# EAGLE design light-painting-brush (EAGLE 9.6.2)
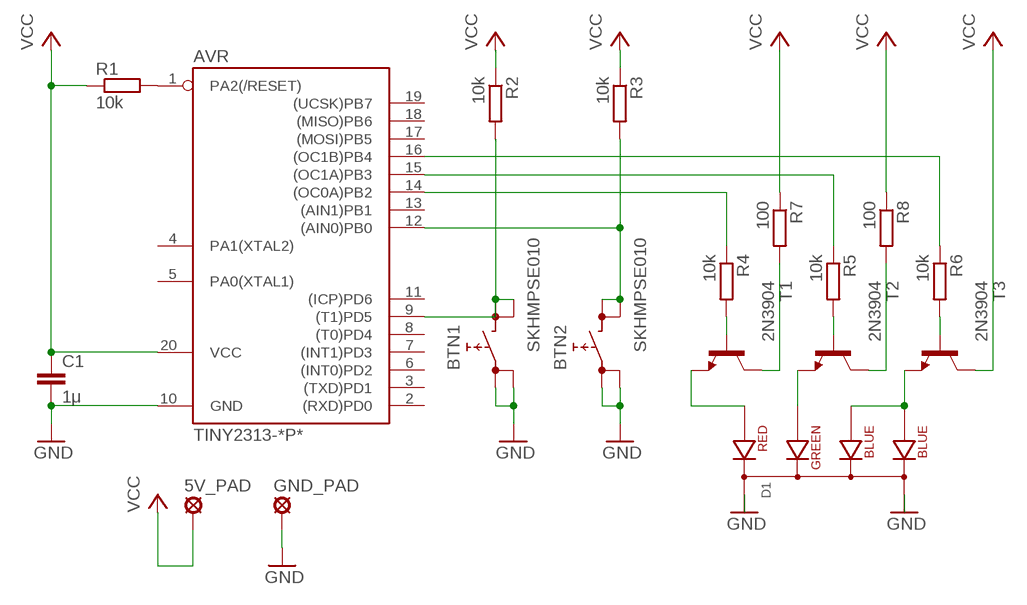
[diagram p0: schematic, sheet 1]

## Parts
5V_PAD  LSP10  [LSP10]
AVR  TINY2313-*P*  [DIL20]
BTN1  SKHMPSE010  [SKHMPXE010]
BTN2  SKHMPSE010  [SKHMPXE010]
C1  1μ  C-EUC1206  [C1206]
D1  LED-RGB-CC-THRUDIFFUSE  [LED-RGB-THRU]
GND_PAD  LSP10  [LSP10]
R1  10k  R-EU_R1206  [R1206]
R2  10k  R-EU_R1206  [R1206]
R3  10k  R-EU_R1206  [R1206]
R4  10k  R-EU_R1206  [R1206]
R5  10k  R-EU_R1206  [R1206]
R6  10k  R-EU_R1206  [R1206]
R7  100  R-EU_R1206  [R1206]
R8  100  R-EU_R1206  [R1206]
T1  2N3904  [TO92]
T2  2N3904  [TO92]
T3  2N3904  [TO92]

## Nets
BLUE: D1.BLUE1 D1.BLUE2 T3.3(E)
BLUE0: AVR.16((OC1B)PB4) R6.1
BLUE1: R6.2 T3.2(B)
GND: AVR.10(GND) BTN1.1(1.1) BTN1.2(1.2) BTN2.1(1.1) BTN2.2(1.2) C1.2 D1.CATHODE1 D1.CATHODE2 GND_PAD.MP
GREEN: D1.GREEN T2.3(E)
GREEN0: AVR.15((OC1A)PB3) R5.1
GREEN1: R5.2 T2.2(B)
GREEN2: R8.2 T2.1(C)
N$1: AVR.1(PA2(/RESET)) R1.2
N$15: AVR.9((T1)PD5) BTN1.3(2.1) BTN1.4(2.2) R2.2
N$16: AVR.12((AIN0)PB0) BTN2.3(2.1) BTN2.4(2.2) R3.2
RED: D1.RED T1.3(E)
RED0: AVR.14((OC0A)PB2) R4.1
RED1: R4.2 T1.2(B)
RED2: R7.2 T1.1(C)
VCC: 5V_PAD.MP AVR.20(VCC) C1.1 R1.1 R2.1 R3.1 R7.1 R8.1 T3.1(C)
Unconnected: AVR.2((RXD)PD0) AVR.3((TXD)PD1) AVR.4(PA1(XTAL2)) AVR.5(PA0(XTAL1)) AVR.6((INT0)PD2) AVR.7((INT1)PD3) AVR.8((T0)PD4) AVR.11((ICP)PD6) AVR.13((AIN1)PB1) AVR.17((MOSI)PB5) AVR.18((MISO)PB6) AVR.19((UCSK)PB7)

## Library data of the parts
5V_PAD GND_PAD = solpad:LSP10: SOLDER PAD drill 1.0 mm, distributor Buerklin, 12H555
AVR = avr-6:TINY2313*: Atmel Tiny2313 2K Flash, 128 bytes EEPROM, 128 bytes RAM
BTN1 BTN2 = Gumix:SKHMP*E010: 6.2 X 6.5mm TACT Switch (SMD) Source: http://www3.alps.co.jp/WebObjects/catalog.woa/PDF/E/Switch/Tact/SKHM/SKHM.PDF
C1 = rcl:C-EU: CAPACITOR, European symbol
D1 = Gumix:LED-RGB-CC-THRU: RGB Through-hole common cathode LED SparkFun Storefront: COM-00105 (Clear) COM-09264 (Diffuse); PROD_ID: DIO-09434
R1-R8 = resistor:R-EU_: RESISTOR, European symbol
T1-T3 = transistor:2N3904: NPN TRANSISTOR

## Board
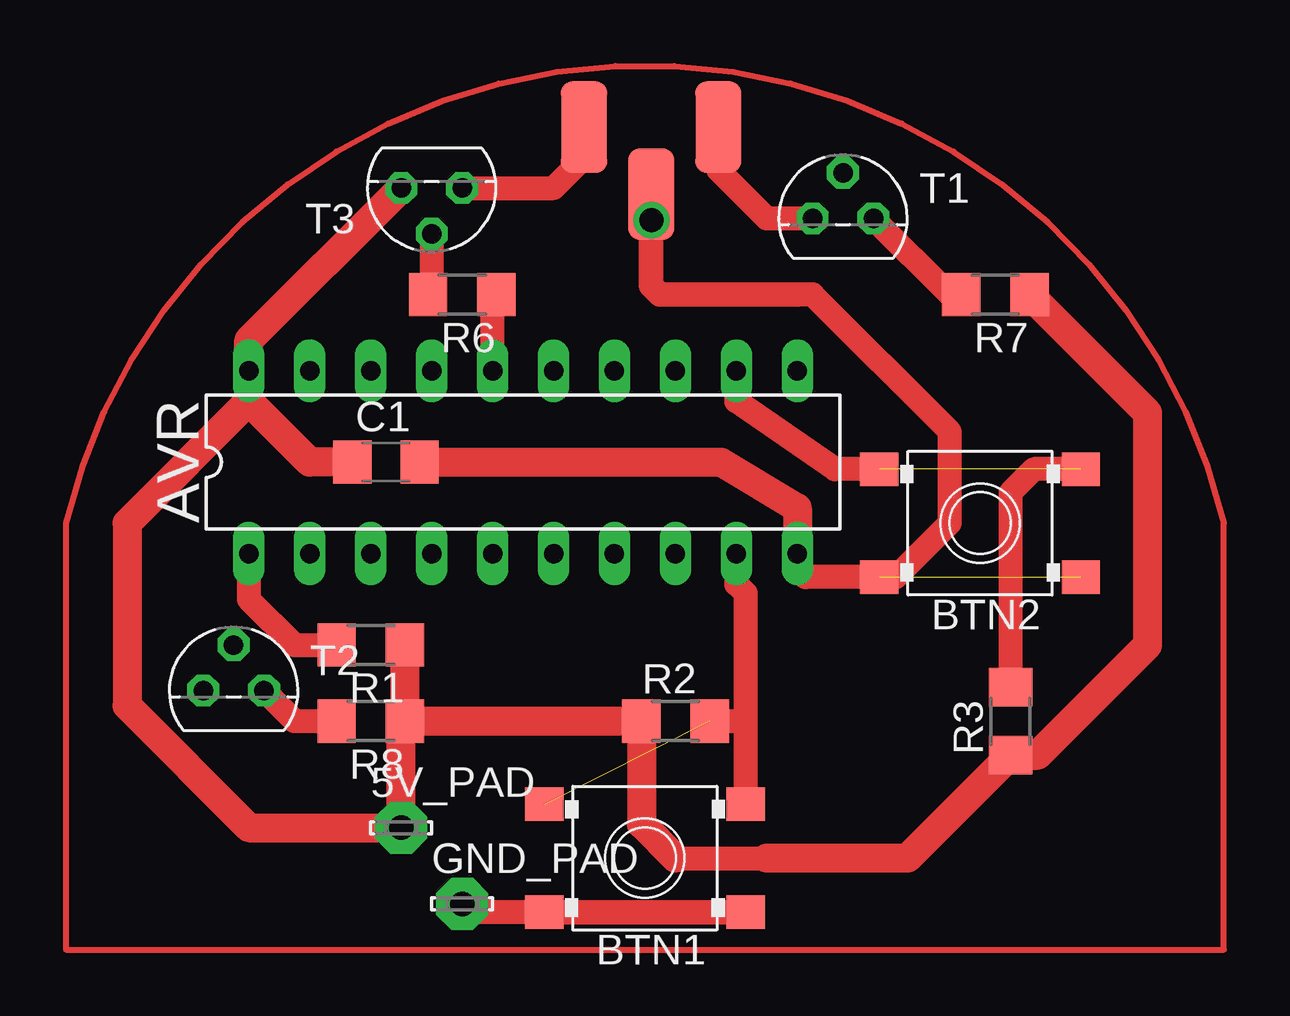
[diagram p1: board, top side]
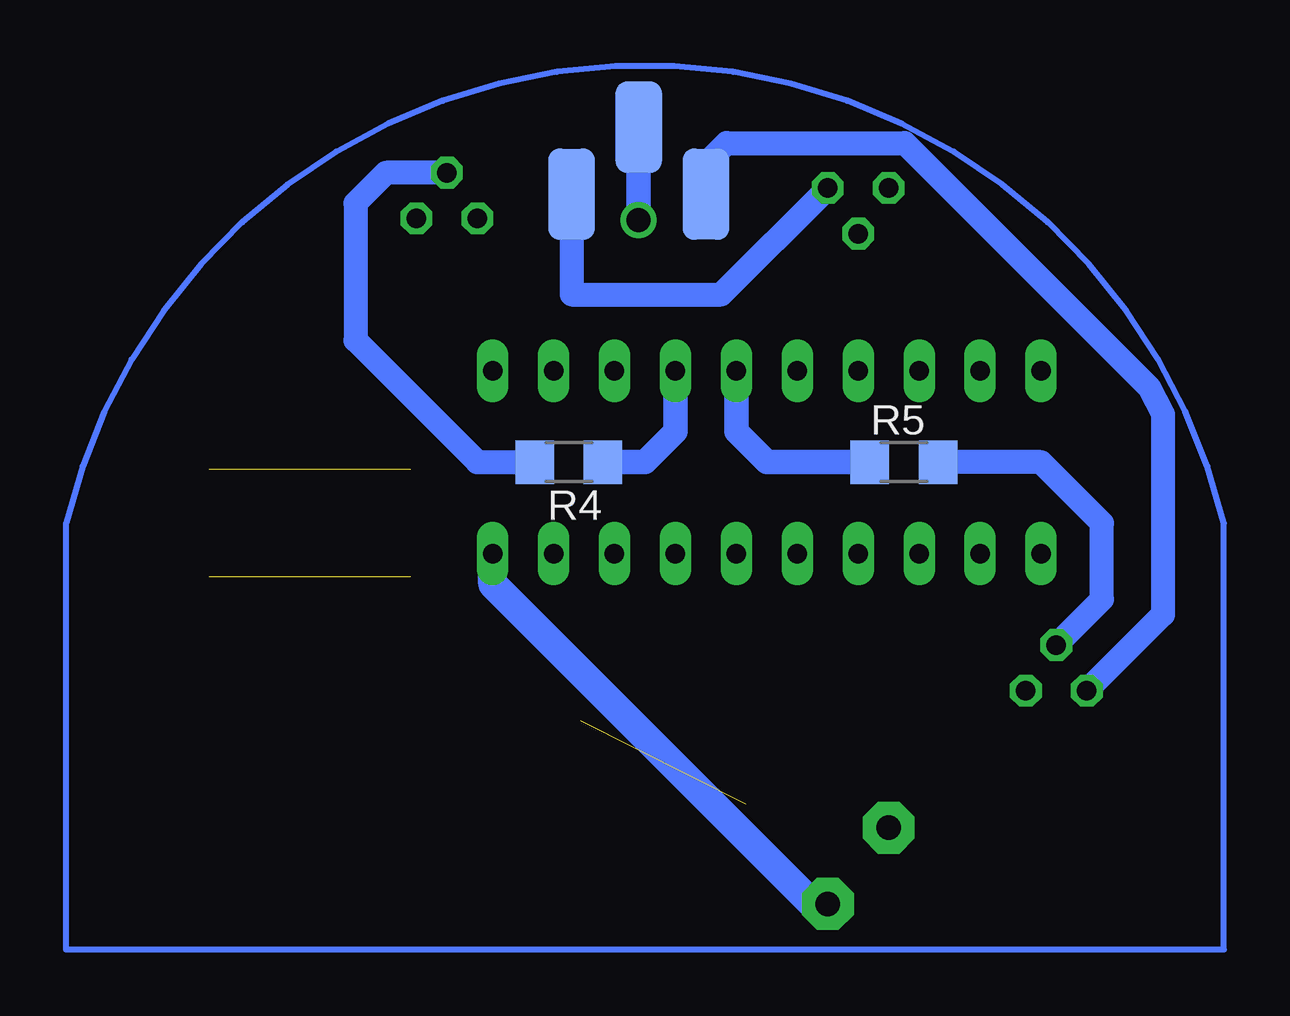
[diagram p2: board, bottom side, seen from below]

No outline drawn. Coordinates in mm, seen from the top.
Copper layers (1*16): Top 0.035mm / dielectric 1.5mm / Bottom 0.035mm
Design rules "default": minimum track width 10mil, minimum drill 24mil, track to track 8mil, track to pad 8mil, pad to pad 8mil, via to via 8mil, smd to smd 8mil, copper to edge 40mil, drill to drill 8mil, minimum pad ring 10mil, minimum via ring 8mil, stop-mask expansion 4mil, vias tented up to drill 0mil, thermal gap 10mil

### Footprints (pad centres in the part's own frame; a part is rotated, then mirrored left to right if it is on the bottom)
LSP10 = drill 1.016 pad 2.159 octagon: MP 0,0
DIL20 = drill 0.813 long: 1 -11.43,-3.81; 2 -8.89,-3.81; 3 -6.35,-3.81; 4 -3.81,-3.81; 5 -1.27,-3.81; 6 1.27,-3.81; 7 3.81,-3.81; 8 6.35,-3.81; 9 8.89,-3.81; 10 11.43,-3.81; 11 11.43,3.81; 12 8.89,3.81; 13 6.35,3.81; 14 3.81,3.81; 15 1.27,3.81; 16 -1.27,3.81; 17 -3.81,3.81; 18 -6.35,3.81; 19 -8.89,3.81; 20 -11.43,3.81
SKHMPXE010 = smd 1.6 x 1.4: 1 -4.2,2.25; 2 4.2,2.25; 3 -4.2,-2.25; 4 4.2,-2.25
C1206 = smd 1.6 x 1.8: 1 -1.4,0; 2 1.4,0
LED-RGB-THRU = smd 1.93 x 3.81: BLUE1 0,0; CATHODE1 2.8,-2.8; RED 5.6,0 | smd 1.93 x 3.81 bottom: BLUE2 5.6,-2.8; CATHODE2 2.8,0; GREEN 0,-2.8
R1206 = smd 1.6 x 1.803: 1 -1.422,0; 2 1.422,0
TO92 = drill 0.813 octagon: 1 1.27,0; 2 0,1.905; 3 -1.27,0

### Placement (x,y rotation side)
5V_PAD  13.97,5.08 0 top
AVR  19.05,20.32 0 top
BTN1  24.13,3.81 180 top
BTN2  38.1,17.78 180 top
C1  13.34,20.32 0 top
D1  21.59,34.29 0 top
GND_PAD  16.51,1.91 0 top
R1  12.7,12.7 180 top
R2  25.4,9.53 0 top
R3  39.37,9.53 90 top
R4  27.3,20.32 180 bottom
R5  13.34,20.32 0 bottom
R6  16.51,27.3 180 top
R7  38.73,27.3 180 top
R8  12.7,9.53 180 top
T1  32.38,30.48 0 top
T2  6.99,10.79 0 top
T3  15.24,31.75 180 top

### Tracks (layer width: path | path; a pad name or v marks a point on that pad's centre or on a via)
BLUE
  Top 1: T3.3 20.32,31.75 21.59,33.02 D1.BLUE1
  Bottom 1: D1.BLUE2 27.19,27.3 20.95,27.3 T3.3
BLUE0
  Top 1: AVR.16 17.78,27.15 R6.1
BLUE1
  Top 1: T3.2 15.24,27.46
  Top 1.016: 15.24,27.46 R6.2
GND  (via drill 1)  (1 unrouted)
  Top 1: BTN1.2 16.86,1.56 GND_PAD.MP | AVR.10 30.48,15.88 30.82,15.53 BTN2.2 34.58,15.53 36.83,17.78 36.83,21.59 31.11,27.3 30.48,27.3
  Top 1.016: 30.48,27.3 24.77,27.3 24.39,27.68 D1.CATHODE1 v24.39,30.41 v24.4,30.4 | BTN1.1 BTN1.2
  Top 1.2: C1.2 27.3,20.32 30.48,18.41 AVR.10
  Bottom 1.016: D1.CATHODE2 v24.39,30.41 v24.4,30.4
  Bottom 1.2: AVR.10 30.48,15.24 17.14,1.91 GND_PAD.MP
GREEN
  Bottom 1: 21.59,31.75 D1.GREEN 21.59,32.76 20.73,33.62 13.3,33.62 3.13,23.45 2.54,22.32 2.54,13.97 T2.3
GREEN0
  Bottom 1.016: AVR.15 20.32,21.59 19.05,20.32 R5.1
GREEN1
  Bottom 1: T2.2 5.08,14.61 5.08,17.78 7.62,20.32 R5.2
GREEN2
  Top 1: T2.1 9.53,9.53 R8.2
N$1
  Top 1: AVR.1 7.62,14.61 9.53,12.7 R1.2
N$15  (1 unrouted)
  Top 1: 28.23,6.06 BTN1.3 28.33,9.53 | 28.33,9.53 28.33,14.85 27.94,15.24 AVR.9 | R2.2 28.33,9.53
N$16  (1 unrouted)
  Top 1: AVR.12 27.94,22.86 32.04,20.03 BTN2.4 | BTN2.3 40.35,20.03 39.37,19.05 R3.2
RED
  Top 1: T1.3 29.21,30.48 27.19,32.5 D1.RED
RED0
  Bottom 1.016: AVR.14 22.86,21.59 24.13,20.32 R4.1
RED1
  Bottom 1: T1.2 34.92,32.38 36.2,31.11 36.2,25.4 31.11,20.32 R4.2
RED2
  Top 1: T1.1 36.83,27.3 R7.2
S$1
  Top 0.254: 0,17.78 arc-153 48.26,17.78 48.26,0 0,0 0,17.78
  Bottom 0.254: 0,0 48.26,0 48.26,17.78 arc153 0,17.78 0,0
VCC
  Top 1: 25.4,3.81 29.21,3.81 30.48,3.81
  Top 1.2: R7.1 45.09,22.38 45.09,12.7 40.49,8.1 R3.1 35.08,3.81 29.21,3.81 | R8.1 R2.1 23.98,5.23 25.4,3.81 | C1.1 10.16,20.32 7.62,22.86 | T3.1 7.62,25.4 AVR.20 7.62,22.86 | 7.62,22.86 2.54,17.78 2.54,10.16 7.62,5.08 5V_PAD.MP 13.97,9.37 R8.1 | R8.1 R1.1